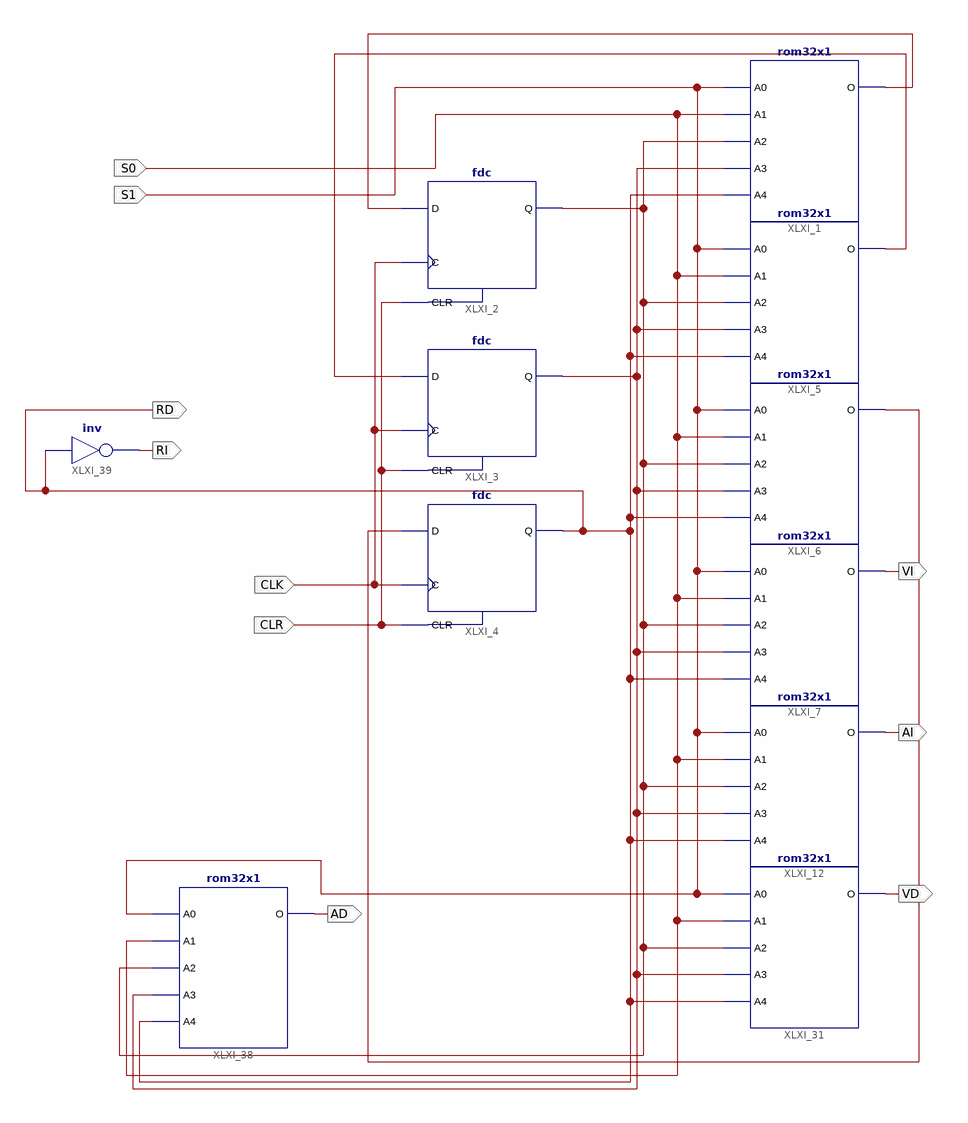
[diagram p0: schematic sheet 1]
// Xilinx ISE schematic p4ej2.sch (spartan3) as structural Verilog: 11 symbols, 10 ports
module p4ej2 (
  input  CLK,
  input  CLR,
  input  S1,
  input  S0,
  output VI,
  output AI,
  output VD,
  output AD,
  output RD,
  output RI
);

  wire XLXN_36, XLXN_37, XLXN_56, XLXN_65, XLXN_70;

  fdc XLXI_2 (.C(CLK), .CLR(CLR), .D(XLXN_36), .Q(XLXN_65));
  fdc XLXI_3 (.C(CLK), .CLR(CLR), .D(XLXN_56), .Q(XLXN_70));
  fdc XLXI_4 (.C(CLK), .CLR(CLR), .D(XLXN_37), .Q(RD));
  rom32x1 #(.INIT("0F090F0A")) XLXI_1 (.A0(S1), .A1(S0), .A2(XLXN_65), .A3(XLXN_70), .A4(RD), .O(XLXN_36));
  rom32x1 #(.INIT("0FF00FF0")) XLXI_5 (.A0(S1), .A1(S0), .A2(XLXN_65), .A3(XLXN_70), .A4(RD), .O(XLXN_56));
  rom32x1 #(.INIT("0FFFF000")) XLXI_6 (.A0(S1), .A1(S0), .A2(XLXN_65), .A3(XLXN_70), .A4(RD), .O(XLXN_37));
  rom32x1 #(.INIT("0FFF0000")) XLXI_7 (.A0(S1), .A1(S0), .A2(XLXN_65), .A3(XLXN_70), .A4(RD), .O(VI));
  rom32x1 #(.INIT("F0000000")) XLXI_12 (.A0(S1), .A1(S0), .A2(XLXN_65), .A3(XLXN_70), .A4(RD), .O(AI));
  rom32x1 #(.INIT("00000FFF")) XLXI_31 (.A0(S1), .A1(S0), .A2(XLXN_65), .A3(XLXN_70), .A4(RD), .O(VD));
  rom32x1 #(.INIT("0000F000")) XLXI_38 (.A0(S1), .A1(S0), .A2(XLXN_65), .A3(XLXN_70), .A4(RD), .O(AD));
  not XLXI_39 (RI, RD);
endmodule
